# EAGLE schematic scheme (EAGLE 7.6.0)
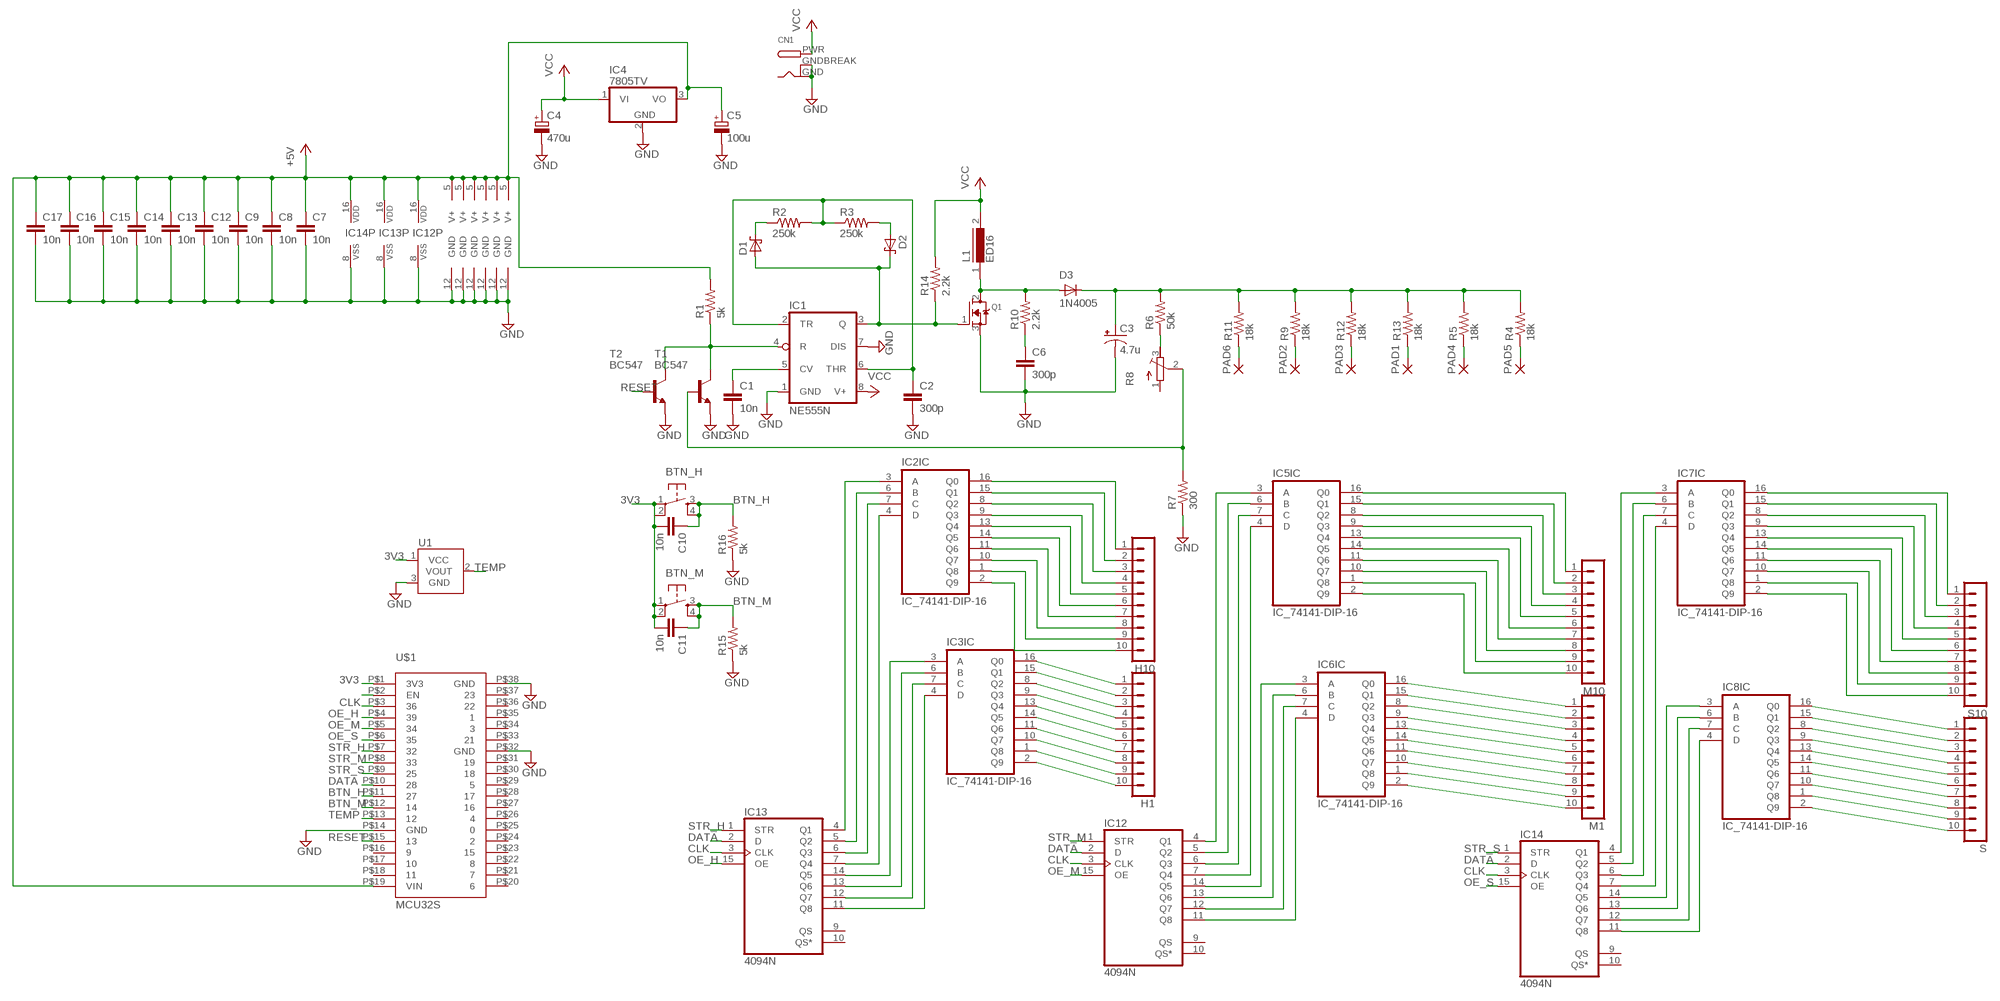
[diagram p0: schematic, sheet 1]

## Parts
BTN_H  TAC_SWITCHPTH  [TACTILE-PTH]
BTN_M  TAC_SWITCHPTH  [TACTILE-PTH]
C1  10n  C-EU050-030X075  [C050-030X075]
C2  300p  C-EU050-030X075  [C050-030X075]
C3  4.7u  CPOL-USE3.5-10  [E3,5-10]
C4  470u  CPOL-EUE5-8.5  [E5-8,5]
C5  100u  CPOL-EUE5-8.5  [E5-8,5]
C6  300p  C-EU050-030X075  [C050-030X075]
C7  10n  C-EU050-030X075  [C050-030X075]
C8  10n  C-EU050-030X075  [C050-030X075]
C9  10n  C-EU050-030X075  [C050-030X075]
C10  10n  C-EU050-030X075  [C050-030X075]
C11  10n  C-EU050-030X075  [C050-030X075]
C12  10n  C-EU050-030X075  [C050-030X075]
C13  10n  C-EU050-030X075  [C050-030X075]
C14  10n  C-EU050-030X075  [C050-030X075]
C15  10n  C-EU050-030X075  [C050-030X075]
C16  10n  C-EU050-030X075  [C050-030X075]
C17  10n  C-EU050-030X075  [C050-030X075]
CN1  DCBARRELPTH  [DCJACK_2MM_PTH]
D1  SCHOTTKY-DIODEF126Z12  [F126Z12]
D2  SCHOTTKY-DIODEF126Z12  [F126Z12]
D3  1N4005  [DO41-10]
H1  MA10-1  [MA10-1]
H10  MA10-1  [MA10-1]
IC1  NE555N  [DIL08]
IC2  IC_74141-DIP-16  [DIL16]
IC3  IC_74141-DIP-16  [DIL16]
IC4  7805TV  [TO220V]
IC5  IC_74141-DIP-16  [DIL16]
IC6  IC_74141-DIP-16  [DIL16]
IC7  IC_74141-DIP-16  [DIL16]
IC8  IC_74141-DIP-16  [DIL16]
IC12  4094N  [DIL16]
IC13  4094N  [DIL16]
IC14  4094N  [DIL16]
L1  ED16  [ED16]
M1  MA10-1  [MA10-1]
M10  MA10-1  [MA10-1]
PAD1  3,17/1,3  [3,17/1,3]
PAD2  3,17/1,3  [3,17/1,3]
PAD3  3,17/1,3  [3,17/1,3]
PAD4  3,17/1,3  [3,17/1,3]
PAD5  3,17/1,3  [3,17/1,3]
PAD6  3,17/1,3  [3,17/1,3]
Q1  MOSFET-NGDS_TO220V  [TO220V]
R1  5k  R-US_0207/10  [0207/10]
R2  250k  R-US_0207/10  [0207/10]
R3  250k  R-US_0207/10  [0207/10]
R4  18k  R-US_0207/10  [0207/10]
R5  18k  R-US_0207/10  [0207/10]
R6  50k  R-US_0207/10  [0207/10]
R7  300  R-US_0207/10  [0207/10]
R8  R-TRIMM3296W  [RTRIM3296W]
R9  18k  R-US_0207/10  [0207/10]
R10  2.2k  R-US_0207/10  [0207/10]
R11  18k  R-US_0207/10  [0207/10]
R12  18k  R-US_0207/10  [0207/10]
R13  18k  R-US_0207/10  [0207/10]
R14  2.2k  R-US_0207/10  [0207/10]
R15  5k  R-US_0207/10  [0207/10]
R16  5k  R-US_0207/10  [0207/10]
S  MA10-1  [MA10-1]
S10  MA10-1  [MA10-1]
T1  BC547  [TO92]
T2  BC547  [TO92]
U1  TMP36GT9  [TO-92]
U$1  MCU32S  [NODEMCU32S]

## Nets
3V3: BTN_H.1 BTN_H.2 BTN_M.1 BTN_M.2 C10.2 C11.2 U1.1(VCC) U$1.P$1(3V3)
BTN_H: BTN_H.3 BTN_H.4 C10.1 R16.2 U$1.P$11
BTN_M: BTN_M.3 BTN_M.4 C11.1 R15.2 U$1.P$12
CLK: IC12.3(CLK) IC13.3(CLK) IC14.3(CLK) U$1.P$3
DATA: IC12.2(D) IC13.2(D) IC14.2(D) U$1.P$10
GND: C1.2 C2.2 C3.- C4.- C5.- C6.2 C7.2 C8.2 C9.2 C12.2 C13.2 C14.2 C15.2 C16.2 C17.2 CN1.GND CN1.GNDBREAK IC1.1(GND) IC1.7(DIS) IC2.12(SUPPLY:GND) IC3.12(SUPPLY:GND) IC4.2(GND) IC5.12(SUPPLY:GND) IC6.12(SUPPLY:GND) IC7.12(SUPPLY:GND) IC8.12(SUPPLY:GND) IC12.8(VSS) IC13.8(VSS) IC14.8(VSS) Q1.3(S) R7.1 R15.1 R16.1 T1.1(E) T2.1(E) U1.3(GND) U$1.P$14(GND) U$1.P$32(GND) U$1.P$38(GND)
N$1: C1.1 IC1.5(CV)
N$2: C2.1 IC1.2(TR) IC1.6(THR) R2.2 R3.1
N$3: C3.+ D3.C R4.2 R5.2 R6.2 R9.2 R11.2 R12.2 R13.2
N$4: D1.A D2.C IC1.3(Q) Q1.1(G) R14.1
N$5: IC1.4(R) R1.1 T1.3(C) T2.3(C)
N$6: H10.1 IC2.16(IC:Q0)
N$7: D2.A R3.2
N$8: D1.C R2.1
N$9: IC2.3(IC:A) IC13.4(Q1)
N$10: D3.A L1.1 Q1.2(D) R10.2
N$11: H10.2 IC2.15(IC:Q1)
N$12: H10.3 IC2.8(IC:Q2)
N$13: H10.4 IC2.9(IC:Q3)
N$14: H10.5 IC2.13(IC:Q4)
N$15: H10.6 IC2.14(IC:Q5)
N$16: H10.7 IC2.11(IC:Q6)
N$17: H10.8 IC2.10(IC:Q7)
N$18: H10.9 IC2.1(IC:Q8)
N$19: H10.10 IC2.2(IC:Q9)
N$20: PAD6.1(P) R11.1
N$21: IC2.7(IC:C) IC13.6(Q3)
N$22: IC2.6(IC:B) IC13.5(Q2)
N$23: IC2.4(IC:D) IC13.7(Q4)
N$24: H1.1 IC3.16(IC:Q0)
N$25: H1.2 IC3.15(IC:Q1)
N$26: H1.3 IC3.8(IC:Q2)
N$27: C6.1 R10.1
N$28: H1.4 IC3.9(IC:Q3)
N$29: H1.5 IC3.13(IC:Q4)
N$30: H1.6 IC3.14(IC:Q5)
N$31: H1.7 IC3.11(IC:Q6)
N$32: R6.1 R8.3(E)
N$33: R7.2 R8.2(S) T1.2(B)
N$34: H1.8 IC3.10(IC:Q7)
N$35: H1.9 IC3.1(IC:Q8)
N$36: H1.10 IC3.2(IC:Q9)
N$37: IC3.7(IC:C) IC13.12(Q7)
N$38: IC3.6(IC:B) IC13.13(Q6)
N$39: IC3.4(IC:D) IC13.11(Q8)
N$40: PAD2.1(P) R9.1
N$41: IC3.3(IC:A) IC13.14(Q5)
N$42: IC6.2(IC:Q9) M1.10
N$43: IC6.1(IC:Q8) M1.9
N$44: IC6.10(IC:Q7) M1.8
N$45: IC6.11(IC:Q6) M1.7
N$46: IC6.14(IC:Q5) M1.6
N$47: IC6.13(IC:Q4) M1.5
N$48: IC6.9(IC:Q3) M1.4
N$49: IC6.8(IC:Q2) M1.3
N$50: IC6.15(IC:Q1) M1.2
N$51: IC6.16(IC:Q0) M1.1
N$52: IC5.7(IC:C) IC12.6(Q3)
N$53: IC5.6(IC:B) IC12.5(Q2)
N$54: IC5.4(IC:D) IC12.7(Q4)
N$55: PAD3.1(P) R12.1
N$56: IC5.3(IC:A) IC12.4(Q1)
N$57: IC5.16(IC:Q0) M10.1
N$58: IC5.15(IC:Q1) M10.2
N$59: IC5.8(IC:Q2) M10.3
N$60: IC5.9(IC:Q3) M10.4
N$61: IC5.13(IC:Q4) M10.5
N$62: IC5.14(IC:Q5) M10.6
N$63: IC5.11(IC:Q6) M10.7
N$64: IC5.10(IC:Q7) M10.8
N$65: IC5.1(IC:Q8) M10.9
N$66: IC5.2(IC:Q9) M10.10
N$67: IC6.6(IC:B) IC12.13(Q6)
N$68: IC8.16(IC:Q0) S.1
N$69: IC8.15(IC:Q1) S.2
N$70: PAD1.1(P) R13.1
N$71: IC6.3(IC:A) IC12.14(Q5)
N$72: IC7.3(IC:A) IC14.4(Q1)
N$73: IC8.8(IC:Q2) S.3
N$74: IC8.9(IC:Q3) S.4
N$75: IC8.13(IC:Q4) S.5
N$76: IC8.14(IC:Q5) S.6
N$77: IC8.11(IC:Q6) S.7
N$78: IC8.10(IC:Q7) S.8
N$79: IC8.2(IC:Q9) S.10
N$80: IC8.1(IC:Q8) S.9
N$81: IC7.16(IC:Q0) S10.1
N$82: IC7.6(IC:B) IC14.5(Q2)
N$83: IC7.7(IC:C) IC14.6(Q3)
N$84: IC7.4(IC:D) IC14.7(Q4)
N$85: PAD4.1(P) R5.1
N$86: IC8.3(IC:A) IC14.14(Q5)
N$87: IC8.6(IC:B) IC14.13(Q6)
N$88: IC7.15(IC:Q1) S10.2
N$89: IC7.8(IC:Q2) S10.3
N$90: IC7.9(IC:Q3) S10.4
N$91: IC7.13(IC:Q4) S10.5
N$92: IC7.14(IC:Q5) S10.6
N$93: IC7.11(IC:Q6) S10.7
N$94: IC7.10(IC:Q7) S10.8
N$95: IC7.1(IC:Q8) S10.9
N$96: IC7.2(IC:Q9) S10.10
N$97: IC8.7(IC:C) IC14.12(Q7)
N$98: IC8.4(IC:D) IC14.11(Q8)
N$99: PAD5.1(P) R4.1
N$100: IC6.7(IC:C) IC12.12(Q7)
N$101: U$1.P$2(EN)
N$102: IC6.4(IC:D) IC12.11(Q8)
OE_H: IC13.15(OE) U$1.P$4
OE_M: IC12.15(OE) U$1.P$5
OE_S: IC14.15(OE) U$1.P$6
RESET: T2.2(B) U$1.P$15
STR_H: IC13.1(STR) U$1.P$7
STR_M: IC12.1(STR) U$1.P$8
STR_S: IC14.1(STR) U$1.P$9
TEMP: U1.2(VOUT) U$1.P$13
V+: C5.+ C7.1 C8.1 C9.1 C12.1 C13.1 C14.1 C15.1 C16.1 C17.1 IC2.5(SUPPLY:V+) IC3.5(SUPPLY:V+) IC4.3(VO) IC5.5(SUPPLY:V+) IC6.5(SUPPLY:V+) IC7.5(SUPPLY:V+) IC8.5(SUPPLY:V+) IC12.16(VDD) IC13.16(VDD) IC14.16(VDD) R1.2 U$1.P$19(VIN) ; supply symbol labelled +5V
VCC: C4.+ CN1.PWR IC1.8(V+) IC4.1(VI) L1.2 R14.2
Unconnected: IC12.9(QS) IC12.10(QS*) IC13.9(QS) IC13.10(QS*) IC14.9(QS) IC14.10(QS*) R8.1(A) U$1.P$16 U$1.P$17 U$1.P$18 U$1.P$20 U$1.P$21 U$1.P$22 U$1.P$23 U$1.P$24 U$1.P$25 U$1.P$26 U$1.P$27 U$1.P$28 U$1.P$29 U$1.P$30 U$1.P$31 U$1.P$33 U$1.P$34 U$1.P$35 U$1.P$36 U$1.P$37

## Library data of the parts
BTN_H BTN_M = SparkFun:TAC_SWITCH: Momentary Switch Button commonly used for reset or general input. Spark Fun Electronics SKU : COM-00097
C1 C2 C6-C17 = rcl:C-EU: CAPACITOR, European symbol
C3 = adafruit:CPOL-US: POLARIZED CAPACITOR, American symbol
C4 C5 = rcl:CPOL-EU: POLARIZED CAPACITOR, European symbol
CN1 = adafruit:DCBARREL: 2.0mm DC Barrel Jack DCJACK_2MM_PTH - Through Hole Jack (4UConnector: 05537)
D1 D2 = adafruit:SCHOTTKY-DIODE: Schottky Diode
D3 = diode:1N4005
H1 H10 M1 M10 S S10 = con-lstb:MA10-1: PIN HEADER; OC_FARNELL: unknown; OC_NEWARK: unknown
IC1 = linear:*555: TIMER
IC2 IC3 IC5-IC8 = dp_devices:IC_74141: BCD to decimal decoder
IC4 = linear:78*: Positive VOLTAGE REGULATOR Source: http://cache.national.com/ds/LM/LM78L05.pdf http://www.fairchildsemi.com/ds/LM/LM7805.pdf
IC12-IC14 = 40xx:4094: 8-stage SHIFT/STORE REGISTER, tri-state
L1 = inductors:ED16: INDUCTOR
PAD1-PAD6 = wirepad:3,17/1,3: THROUGH-HOLE PAD
Q1 = adafruit:MOSFET-N: N-Channel Mosfet 2N7002E - 60V 260mA SOT23 [Digikey: 2N7002ET1GOSTR-ND] - REEL BSH103 - 30V 850mA SOT23 [Digikey: 568-5013-1-ND]
R1-R7 R9-R16 = rcl:R-US_: RESISTOR, American symbol
R8 = resistor:R-TRIMM: Trimm resistor
T1 T2 = transistor:BC547: NPN TRANSISTOR
U1 = SparkFun:TMP36
U$1 = nodeMCU:MCU32S